# EasyEDA schematic SCH_Landing Gear Panel v2_2021-07-29.json
TITLE: Landing Gear panel; REV: 1.0; Date: 2021-06-01; Sheet: 1/1; Drawn By: tuomas.kuosmanen; Company: TigertFly
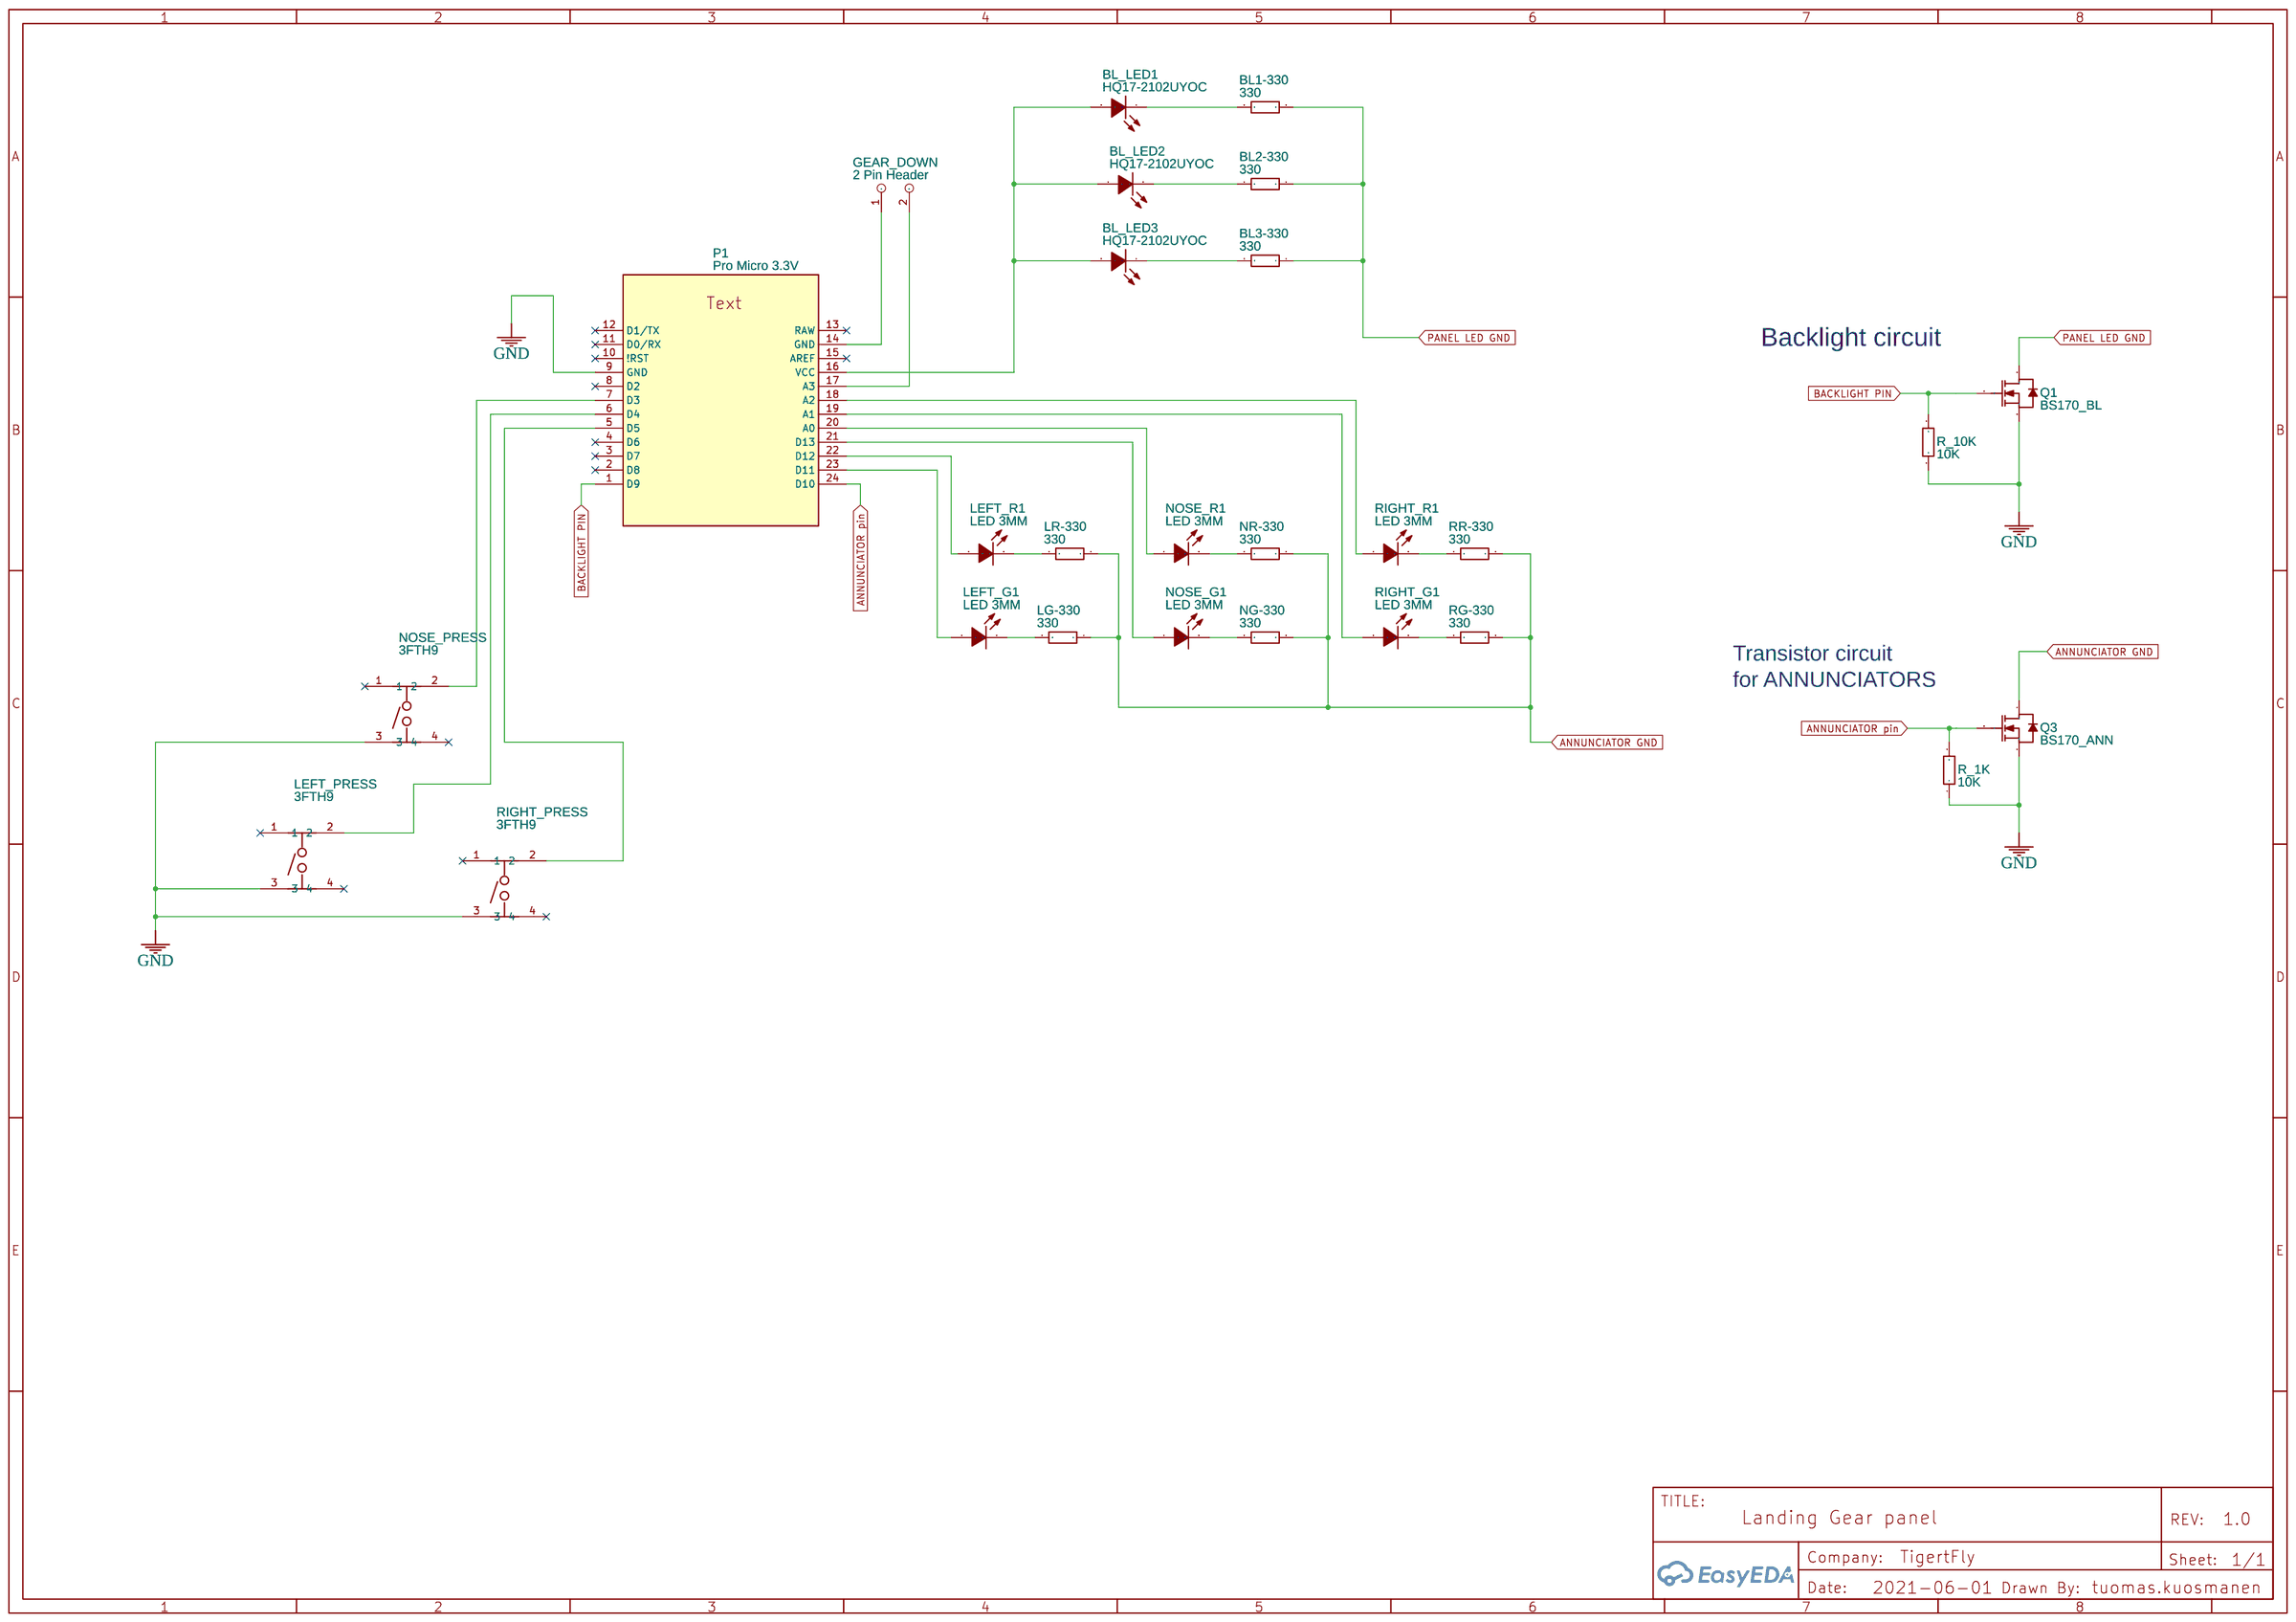
[diagram p0: schematic sheet]

## Parts
BL1-330  330  [R1206]
BL2-330  330  [R1206]
BL3-330  330  [R1206]
BL_LED1  HQ17-2102UYOC  [LED1206-RD]
BL_LED2  HQ17-2102UYOC  [LED1206-RD]
BL_LED3  HQ17-2102UYOC  [LED1206-RD]
GEAR_DOWN  2 Pin Header  [HDR1X2]
LEFT_G1  LED 3MM  [LED-TH_BD3.8-P2.54-FD]
LEFT_PRESS  3FTH9  [TACTILE]
LEFT_R1  LED 3MM  [LED-TH_BD3.8-P2.54-FD]
LG-330  330  [R1206]
LR-330  330  [R1206]
NG-330  330  [R1206]
NOSE_G1  LED 3MM  [LED-TH_BD3.8-P2.54-FD]
NOSE_PRESS  3FTH9  [TACTILE]
NOSE_R1  LED 3MM  [LED-TH_BD3.8-P2.54-FD]
NR-330  330  [R1206]
P1  Pro Micro 3.3V  [PRO MICRO 3.3V]
Q1  BS170_BL  [TO-92-3_L4.9-W3.7-P1.27-L]
Q3  BS170_ANN  [TO-92-3_L4.9-W3.7-P1.27-L]
R_1K  10K  [R1206]
R_10K  10K  [R1206]
RG-330  330  [R1206]
RIGHT_G1  LED 3MM  [LED-TH_BD3.8-P2.54-FD]
RIGHT_PRESS  3FTH9  [TACTILE]
RIGHT_R1  LED 3MM  [LED-TH_BD3.8-P2.54-FD]
RR-330  330  [R1206]

## Library data of the parts
BL1-330 BL2-330 BL3-330 LG-330 LR-330 NG-330 NR-330 R_1K R_10K RG-330 RR-330 = 1206W4J0331T5E: Supplier: LCSC; Manufacturer: UniOhm; Supplier Part: C25374
BL_LED1-BL_LED3 = HQ17-2102UYOC: Supplier: LCSC; Manufacturer: HARVATEK; Contributor: LCSC; Supplier Part: C154481; JLCPCB Part Class: Extended Part
GEAR_DOWN = 2 Pin Header: Contributor: Adafruit; sourceId: 0SMGAR9rl
LEFT_G1 LEFT_R1 NOSE_G1 NOSE_R1 RIGHT_G1 RIGHT_R1 = LED 3MM: Supplier: LCSC; Manufacturer: KENTO; image: //image.lceda.cn/szlcsc/C62095.jpg; Supplier Part: C62095; Contributor: subzero69
LEFT_PRESS NOSE_PRESS RIGHT_PRESS = 3FTH9: Manufacturer: MEC Switches; Supplier: Digi-Key; Supplier Part: 679-3730-5-ND; link: https://www.digikey.dk/product-detail/da/mec-switches/3FTH9/679-3730-5-ND/4376513; Contributor: Goose83
P1 = Pro Micro 3.3V: sourceId: UbZz96Gge; Supplier Part: 12587; Supplier: SparkFun
Q1 Q3 = BS170: Supplier: LCSC; Manufacturer: FAIRCHILD; Supplier Part: C111691; JLCPCB Part Class: Extended Part

## Nets
GND: LEFT_PRESS.3 NOSE_PRESS.3 P1.9(GND) Q1.3(S) Q3.3(S) R_1K.1 R_10K.1 RIGHT_PRESS.3
ANNUNCIATOR GND: LG-330.1 LR-330.1 NG-330.1 NR-330.1 Q3.1(D) RG-330.1 RR-330.1
ANNUNCIATOR pin: P1.24(D10) Q3.2(G) R_1K.2
BACKLIGHT PIN: P1.1(D9) Q1.2(G) R_10K.2
PANEL LED GND: BL1-330.1 BL2-330.1 BL3-330.1 Q1.1(D)
Net-(BL1-330-2): BL1-330.2 BL_LED1.1(K)
Net-(BL2-330-2): BL2-330.2 BL_LED2.1(K)
Net-(BL3-330-2): BL3-330.2 BL_LED3.1(K)
Net-(BL_LED1-2): BL_LED1.2(A) BL_LED2.2(A) BL_LED3.2(A) P1.16(VCC)
Net-(GEAR_DOWN-1): GEAR_DOWN.1 P1.14(GND)
Net-(GEAR_DOWN-2): GEAR_DOWN.2 P1.17(A3)
Net-(LEFT_G1-1): LEFT_G1.1(A) P1.23(D11)
Net-(LEFT_G1-2): LEFT_G1.2(K) LG-330.2
Net-(LEFT_PRESS-2): LEFT_PRESS.2 P1.6(D4)
Net-(LEFT_R1-1): LEFT_R1.1(A) P1.22(D12)
Net-(LEFT_R1-2): LEFT_R1.2(K) LR-330.2
Net-(NG-330-2): NG-330.2 NOSE_G1.2(K)
Net-(NOSE_G1-1): NOSE_G1.1(A) P1.21(D13)
Net-(NOSE_PRESS-2): NOSE_PRESS.2 P1.7(D3)
Net-(NOSE_R1-1): NOSE_R1.1(A) P1.20(A0)
Net-(NOSE_R1-2): NOSE_R1.2(K) NR-330.2
Net-(P1-5): P1.5(D5) RIGHT_PRESS.2
Net-(P1-18): P1.18(A2) RIGHT_R1.1(A)
Net-(P1-19): P1.19(A1) RIGHT_G1.1(A)
Net-(RG-330-2): RG-330.2 RIGHT_G1.2(K)
Net-(RIGHT_R1-2): RIGHT_R1.2(K) RR-330.2

Not connected (* = marked no-connect by the designer): LEFT_PRESS 1* 4*; NOSE_PRESS 1* 4*; P1 2(D8)* 3(D7)* 4(D6)* 8(D2)* 10(!RST)* 11(D0/RX)* 12(D1/TX)* 13(RAW)* 15(AREF)*; RIGHT_PRESS 1* 4*

## Notes on the sheet
- Backlight circuit
- Transistor circuit
  for ANNUNCIATORS
